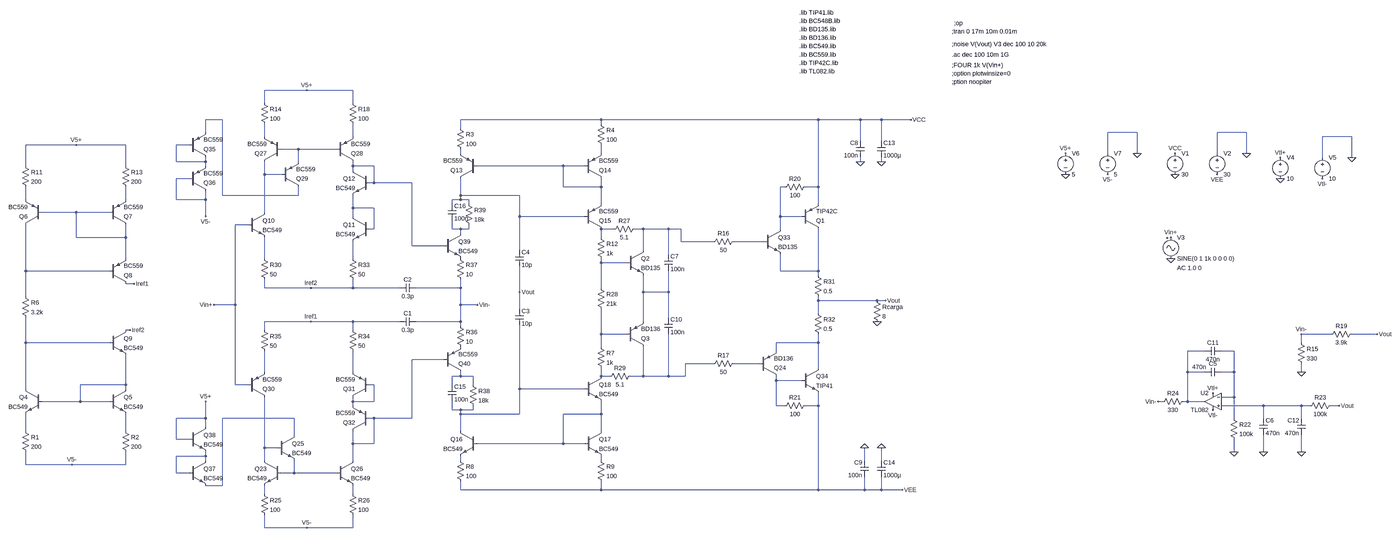
[diagram p0: schematic Current_Feedback_Amplifier.asc, whole sheet]
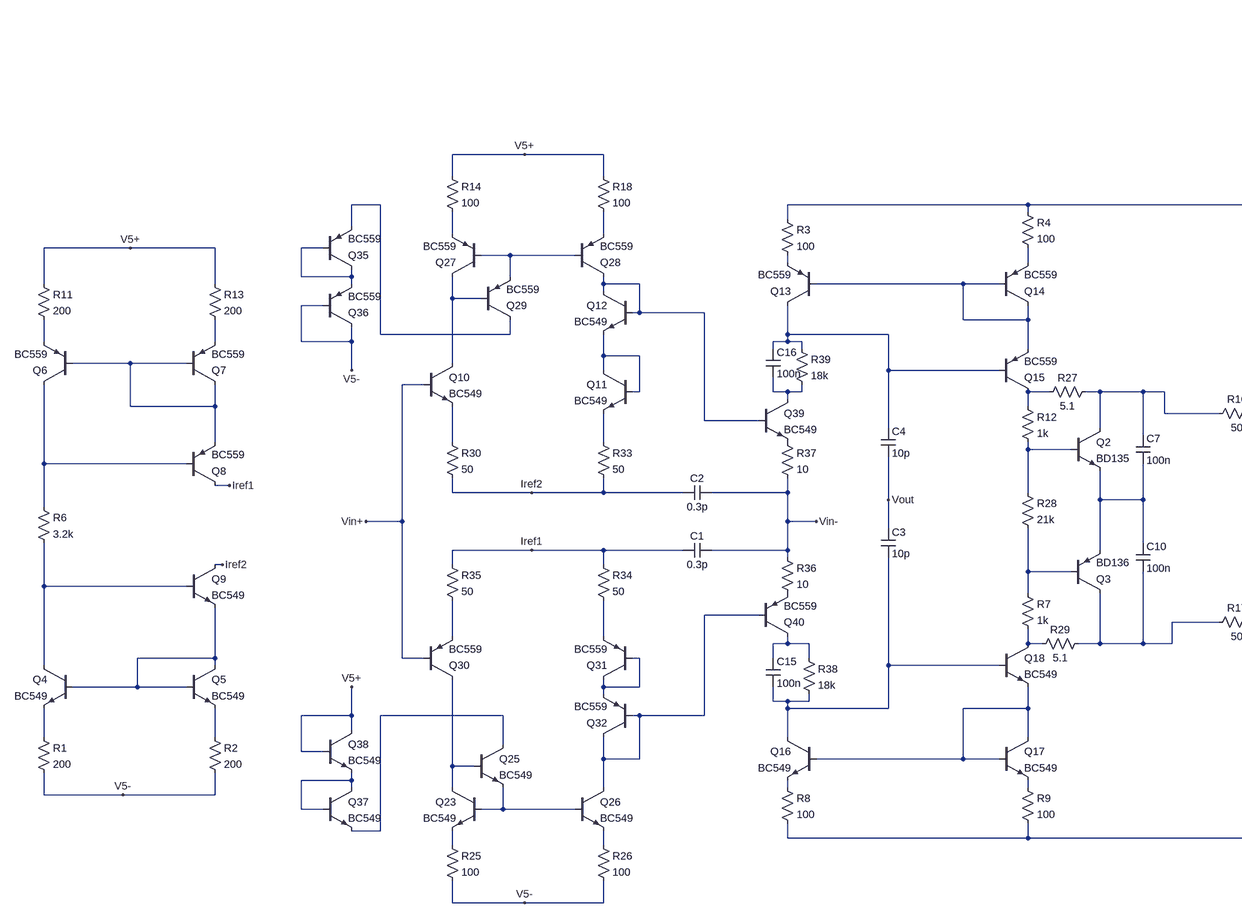
[diagram p1: schematic Current_Feedback_Amplifier.asc, part, row 1 of 1, column 1 of 2]
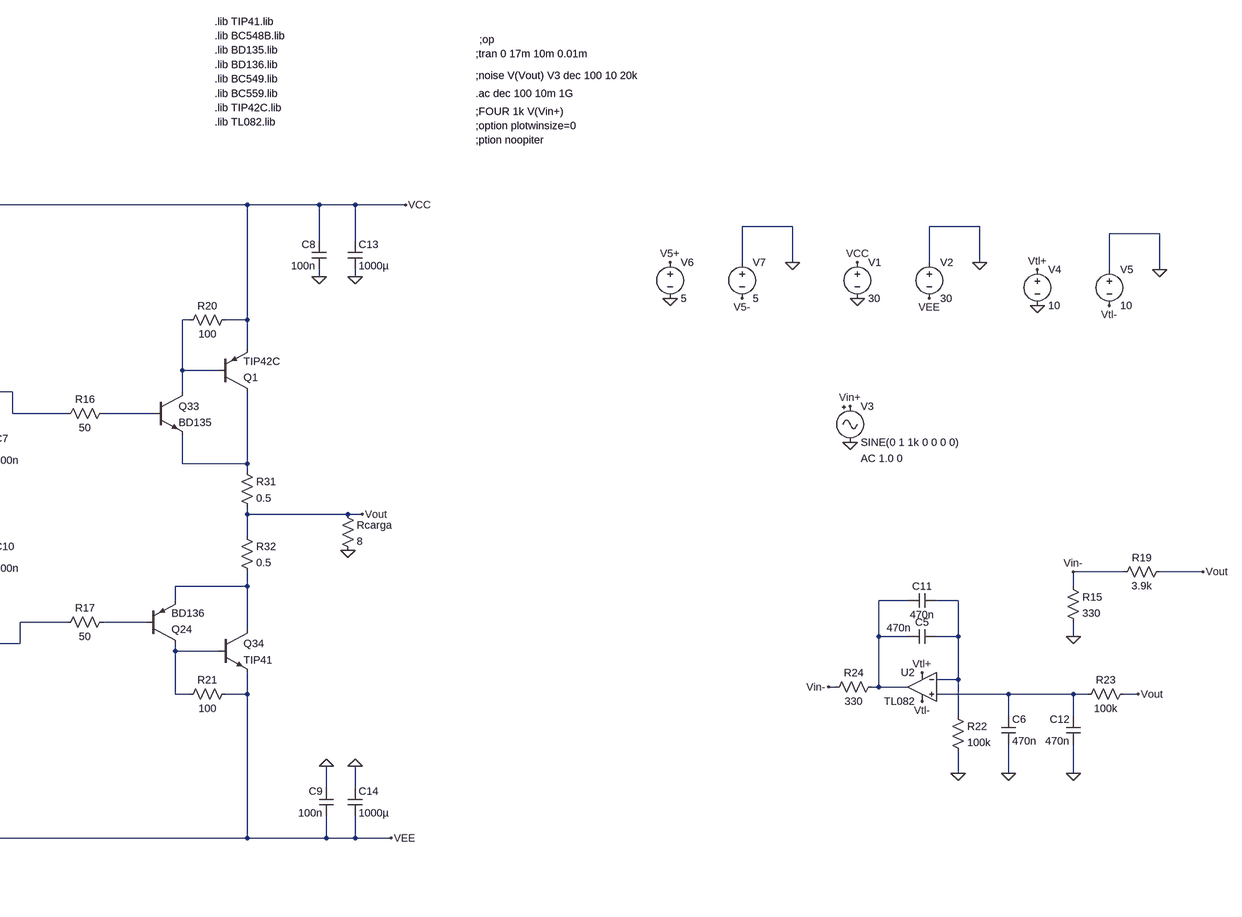
[diagram p2: schematic Current_Feedback_Amplifier.asc, part, row 1 of 1, column 2 of 2]
Current_Feedback_Amplifier.asc, the LTspice schematic file:
Version 4
SHEET 1 5144 1460
WIRE 496 -352 336 -352
WIRE 672 -352 496 -352
WIRE 336 -304 336 -352
WIRE 672 -304 672 -352
WIRE 160 -240 112 -240
WIRE 176 -240 160 -240
WIRE 1648 -240 1104 -240
WIRE 2848 -240 1648 -240
WIRE 3008 -240 2848 -240
WIRE 3088 -240 3008 -240
WIRE 3200 -240 3088 -240
WIRE 1648 -224 1648 -240
WIRE 1104 -208 1104 -240
WIRE 112 -192 112 -240
WIRE 4160 -192 4048 -192
WIRE 4576 -192 4464 -192
WIRE 336 -176 336 -224
WIRE 672 -176 672 -224
WIRE 4976 -176 4864 -176
WIRE 3008 -160 3008 -240
WIRE 3088 -160 3088 -240
WIRE -560 -144 -752 -144
WIRE -368 -144 -560 -144
WIRE 48 -144 0 -144
WIRE 464 -128 400 -128
WIRE 608 -128 464 -128
WIRE 1104 -112 1104 -128
WIRE 1648 -112 1648 -144
WIRE 4048 -112 4048 -192
WIRE 4160 -112 4160 -192
WIRE 4464 -112 4464 -192
WIRE 4576 -112 4576 -192
WIRE 4864 -96 4864 -176
WIRE 4976 -96 4976 -176
WIRE 0 -80 0 -144
WIRE 112 -80 112 -96
WIRE 112 -80 0 -80
WIRE 464 -80 464 -128
WIRE 3008 -80 3008 -96
WIRE 3088 -80 3088 -96
WIRE -752 -64 -752 -144
WIRE -368 -64 -368 -144
WIRE 112 -64 112 -80
WIRE 672 -64 672 -80
WIRE 752 -64 672 -64
WIRE 1504 -64 1168 -64
WIRE 1584 -64 1504 -64
WIRE 672 -48 672 -64
WIRE 336 -32 336 -80
WIRE 400 -32 336 -32
WIRE 48 -16 0 -16
WIRE 752 0 752 -64
WIRE 752 0 736 0
WIRE 896 0 752 0
WIRE 1504 16 1504 -64
WIRE 1648 16 1648 -16
WIRE 1648 16 1504 16
WIRE 2720 16 2704 16
WIRE 2848 16 2848 -240
WIRE 2848 16 2800 16
WIRE 176 48 176 -240
WIRE 464 48 464 16
WIRE 464 48 176 48
WIRE 1104 48 1104 -16
WIRE 1328 48 1104 48
WIRE -752 64 -752 16
WIRE -368 64 -368 16
WIRE 0 64 0 -16
WIRE 112 64 112 32
WIRE 112 64 0 64
WIRE 1104 64 1104 48
WIRE 1104 64 1072 64
WIRE 1136 64 1104 64
WIRE 1072 80 1072 64
WIRE 1136 80 1136 64
WIRE 1648 80 1648 16
WIRE 2848 80 2848 16
WIRE 672 96 672 48
WIRE 752 96 672 96
WIRE -560 112 -688 112
WIRE -432 112 -560 112
WIRE 336 112 336 -32
WIRE 112 128 112 64
WIRE 672 128 672 96
WIRE 1328 128 1328 48
WIRE 1584 128 1328 128
WIRE 2704 128 2704 16
WIRE 2784 128 2704 128
WIRE 272 160 224 160
WIRE 752 176 752 96
WIRE 752 176 736 176
WIRE 1072 176 1072 144
WIRE 1104 176 1072 176
WIRE 1136 176 1136 160
WIRE 1136 176 1104 176
WIRE 1696 176 1648 176
WIRE 1808 176 1776 176
WIRE 1904 176 1808 176
WIRE 1952 176 1904 176
WIRE 2704 176 2704 128
WIRE 1104 192 1104 176
WIRE 1648 192 1648 176
WIRE -560 208 -560 112
WIRE -368 208 -368 160
WIRE -368 208 -560 208
WIRE 1648 208 1648 192
WIRE 1952 224 1952 176
WIRE 2336 224 1952 224
WIRE 2448 224 2336 224
WIRE 2640 224 2528 224
WIRE 896 240 896 0
WIRE 1040 240 896 240
WIRE 1328 256 1328 128
WIRE 1808 256 1808 176
WIRE 1904 272 1904 176
WIRE -368 288 -368 208
WIRE 336 288 336 208
WIRE 672 288 672 224
WIRE 1648 304 1648 288
WIRE 1744 304 1648 304
WIRE -752 336 -752 160
WIRE -432 336 -752 336
WIRE 2704 336 2704 272
WIRE 2848 336 2848 176
WIRE 2848 336 2704 336
WIRE 2848 352 2848 336
WIRE -336 384 -368 384
WIRE 336 400 336 368
WIRE 512 400 336 400
WIRE 672 400 672 368
WIRE 672 400 512 400
WIRE 848 400 672 400
WIRE 1104 400 1104 368
WIRE 1104 400 912 400
WIRE 1648 400 1648 304
WIRE 1328 416 1328 320
WIRE 1808 416 1808 352
WIRE 1904 416 1904 336
WIRE 1904 416 1808 416
WIRE -752 432 -752 336
WIRE 2848 448 2848 432
WIRE 3072 448 2848 448
WIRE 3104 448 3072 448
WIRE 224 464 224 160
WIRE 224 464 144 464
WIRE 1104 464 1104 400
WIRE 1168 464 1104 464
WIRE 1328 480 1328 416
WIRE 2848 496 2848 448
WIRE 1904 512 1904 416
WIRE 512 528 336 528
WIRE 672 528 512 528
WIRE 848 528 672 528
WIRE 1104 528 1104 464
WIRE 1104 528 912 528
WIRE 1808 528 1808 416
WIRE 1104 544 1104 528
WIRE -352 560 -368 560
WIRE 336 560 336 528
WIRE 672 560 672 528
WIRE 1648 576 1648 480
WIRE 1744 576 1648 576
WIRE 4896 576 4784 576
WIRE 5072 576 4976 576
WIRE -752 608 -752 512
WIRE -432 608 -752 608
WIRE 2848 608 2848 576
WIRE 2848 608 2688 608
WIRE 4784 608 4784 576
WIRE 1648 624 1648 576
WIRE 2688 640 2688 608
WIRE 4416 640 4352 640
WIRE 4528 640 4480 640
WIRE 1040 672 896 672
WIRE 2368 688 1968 688
WIRE 2448 688 2368 688
WIRE 2624 688 2528 688
WIRE 2848 704 2848 608
WIRE 336 720 336 640
WIRE 672 720 672 640
WIRE 1648 720 1648 704
WIRE 4352 720 4352 640
WIRE 4416 720 4352 720
WIRE 4528 720 4528 640
WIRE 4528 720 4480 720
WIRE 4784 720 4784 688
WIRE 1104 736 1104 720
WIRE 1104 736 1072 736
WIRE 1152 736 1104 736
WIRE 1648 736 1648 720
WIRE 1680 736 1648 736
WIRE 1808 736 1808 624
WIRE 1808 736 1760 736
WIRE 1904 736 1904 576
WIRE 1904 736 1808 736
WIRE 1968 736 1968 688
WIRE 1968 736 1904 736
WIRE 2688 752 2688 736
WIRE 2784 752 2688 752
WIRE -368 768 -368 656
WIRE -368 768 -544 768
WIRE 224 768 224 464
WIRE 272 768 224 768
WIRE 752 768 736 768
WIRE 1072 768 1072 736
WIRE 1152 768 1152 736
WIRE -752 784 -752 608
WIRE -368 784 -368 768
WIRE 1328 784 1328 544
WIRE 1584 784 1328 784
WIRE 4528 816 4528 720
WIRE 4528 816 4480 816
WIRE -544 832 -544 768
WIRE -544 832 -688 832
WIRE -432 832 -544 832
WIRE 672 832 672 816
WIRE 752 832 752 768
WIRE 752 832 672 832
WIRE 4256 832 4240 832
WIRE 4352 832 4352 720
WIRE 4352 832 4336 832
WIRE 4416 832 4352 832
WIRE 672 848 672 832
WIRE 2688 848 2688 752
WIRE 2720 848 2688 848
WIRE 2848 848 2848 800
WIRE 2848 848 2800 848
WIRE 4640 848 4480 848
WIRE 4784 848 4640 848
WIRE 4816 848 4784 848
WIRE 4928 848 4896 848
WIRE 1072 864 1072 832
WIRE 1104 864 1072 864
WIRE 1152 864 1152 848
WIRE 1152 864 1104 864
WIRE 1104 880 1104 864
WIRE 1328 880 1328 784
WIRE 1328 880 1104 880
WIRE 1648 880 1648 832
WIRE 1648 880 1504 880
WIRE 112 896 112 832
WIRE 112 896 0 896
WIRE 448 896 176 896
WIRE 752 896 736 896
WIRE 896 896 896 672
WIRE 896 896 752 896
WIRE 4528 896 4528 816
WIRE 4640 896 4640 848
WIRE 4784 896 4784 848
WIRE 112 928 112 896
WIRE -752 944 -752 880
WIRE -368 944 -368 880
WIRE 1104 944 1104 880
WIRE 1648 944 1648 880
WIRE 448 960 448 896
WIRE 0 976 0 896
WIRE 48 976 0 976
WIRE 672 992 672 944
WIRE 752 992 752 896
WIRE 752 992 672 992
WIRE 1472 992 1168 992
WIRE 1504 992 1504 880
WIRE 1504 992 1472 992
WIRE 1584 992 1504 992
WIRE 336 1008 336 816
WIRE 384 1008 336 1008
WIRE 4528 1024 4528 976
WIRE 4640 1024 4640 960
WIRE 4784 1024 4784 960
WIRE 112 1040 112 1024
WIRE 112 1040 0 1040
WIRE 112 1056 112 1040
WIRE 336 1056 336 1008
WIRE 672 1056 672 992
WIRE 1104 1056 1104 1040
WIRE 1648 1056 1648 1040
WIRE 3024 1056 3024 1008
WIRE 3088 1056 3088 1008
WIRE -752 1072 -752 1024
WIRE -576 1072 -752 1072
WIRE -368 1072 -368 1024
WIRE -368 1072 -576 1072
WIRE 0 1104 0 1040
WIRE 48 1104 0 1104
WIRE 448 1104 448 1056
WIRE 448 1104 400 1104
WIRE 608 1104 448 1104
WIRE 144 1152 112 1152
WIRE 176 1152 176 896
WIRE 176 1152 144 1152
WIRE 1104 1168 1104 1136
WIRE 1648 1168 1648 1136
WIRE 1648 1168 1104 1168
WIRE 2848 1168 2848 848
WIRE 2848 1168 1648 1168
WIRE 3024 1168 3024 1120
WIRE 3024 1168 2848 1168
WIRE 3088 1168 3088 1120
WIRE 3088 1168 3024 1168
WIRE 3168 1168 3088 1168
WIRE 336 1184 336 1152
WIRE 672 1184 672 1152
WIRE 336 1312 336 1264
WIRE 496 1312 336 1312
WIRE 672 1312 672 1264
WIRE 672 1312 496 1312
FLAG 4304 -112 VCC
FLAG 4304 -32 0
FLAG 4576 -112 0
FLAG 4464 -32 VEE
FLAG 4288 288 0
FLAG 4288 208 Vin+
FLAG 3104 448 Vout
FLAG 4784 720 0
FLAG 4784 576 Vin-
FLAG 5072 576 Vout
FLAG 3072 528 0
FLAG 4528 1024 0
FLAG 4640 1024 0
FLAG 4928 848 Vout
FLAG 4240 832 Vin-
FLAG 4448 864 Vtl-
FLAG 4448 800 Vtl+
FLAG 3168 1168 VEE
FLAG 3024 1008 0
FLAG 3200 -240 VCC
FLAG 3008 -80 0
FLAG 4704 -96 Vtl+
FLAG 4704 -16 0
FLAG 4976 -96 0
FLAG 4864 -16 Vtl-
FLAG 4784 1024 0
FLAG 3088 -80 0
FLAG 3088 1008 0
FLAG 1328 416 Vout
FLAG 3888 -112 V5+
FLAG 3888 -32 0
FLAG 4160 -112 0
FLAG 4048 -32 V5-
FLAG 144 464 Vin+
FLAG 1168 464 Vin-
FLAG 496 -352 V5+
FLAG 496 1312 V5-
FLAG -560 -144 V5+
FLAG -576 1072 V5-
FLAG 112 128 V5-
FLAG 112 832 V5+
FLAG 512 528 Iref1
FLAG -336 384 Iref1
FLAG 512 400 Iref2
FLAG -352 560 Iref2
DATAFLAG 1504 -64 ""
DATAFLAG 160 -240 ""
DATAFLAG 144 1152 ""
DATAFLAG 1104 464 ""
DATAFLAG 224 464 ""
DATAFLAG 1104 48 ""
DATAFLAG 1104 880 ""
DATAFLAG 1472 992 ""
DATAFLAG 1648 192 ""
DATAFLAG 1648 720 ""
DATAFLAG 1648 720 ""
DATAFLAG 2848 448 ""
DATAFLAG 2704 128 ""
DATAFLAG 2688 752 ""
DATAFLAG 2368 688 ""
DATAFLAG 2336 224 ""
SYMBOL voltage 4304 -128 R0
WINDOW 123 0 0 Left 2
WINDOW 39 0 0 Left 2
SYMATTR InstName V1
SYMATTR Value 30
SYMBOL voltage 4464 -128 R0
SYMATTR InstName V2
SYMATTR Value 30
SYMBOL Misc\\signal 4288 192 R0
WINDOW 123 24 132 Left 2
WINDOW 39 0 0 Left 2
SYMATTR Value2 AC 1.0 0
SYMATTR InstName V3
SYMATTR Value SINE(0 1 1k 0 0 0 0)
SYMBOL npn 1168 944 M0
SYMATTR InstName Q16
SYMATTR Value BC549
SYMBOL res 1088 1040 R0
SYMATTR InstName R8
SYMATTR Value 100
SYMBOL npn 1584 944 R0
SYMATTR InstName Q17
SYMATTR Value BC549
SYMBOL res 1632 1040 R0
SYMATTR InstName R9
SYMATTR Value 100
SYMBOL npn 1584 736 R0
SYMATTR InstName Q18
SYMATTR Value BC549
SYMBOL pnp 1584 176 M180
SYMATTR InstName Q15
SYMATTR Value BC559
SYMBOL pnp 1584 -16 M180
SYMATTR InstName Q14
SYMATTR Value BC559
SYMBOL res 1632 -240 R0
SYMATTR InstName R4
SYMATTR Value 100
SYMBOL pnp 1168 -16 R180
SYMATTR InstName Q13
SYMATTR Value BC559
SYMBOL res 1088 -224 R0
SYMATTR InstName R3
SYMATTR Value 100
SYMBOL res 2544 672 R90
WINDOW 0 0 56 VBottom 2
WINDOW 3 32 56 VTop 2
SYMATTR InstName R17
SYMATTR Value 50
SYMBOL res 2544 208 R90
WINDOW 0 0 56 VBottom 2
WINDOW 3 32 56 VTop 2
SYMATTR InstName R16
SYMATTR Value 50
SYMBOL pnp 2624 736 M180
SYMATTR InstName Q24
SYMATTR Value BD136
SYMBOL cap 1312 480 R0
SYMATTR InstName C3
SYMATTR Value 10p
SYMBOL cap 1312 256 R0
SYMATTR InstName C4
SYMATTR Value 10p
SYMBOL res 4768 592 R0
SYMATTR InstName R15
SYMATTR Value 330
SYMBOL res 4992 560 R90
WINDOW 0 0 56 VBottom 2
WINDOW 3 32 56 VTop 2
SYMATTR InstName R19
SYMATTR Value 3.9k
SYMBOL res 3056 432 R0
SYMATTR InstName Rcarga
SYMATTR Value 8
SYMBOL npn 2640 176 R0
SYMATTR InstName Q33
SYMATTR Value BD135
SYMBOL res 2816 0 R90
WINDOW 0 0 56 VBottom 2
WINDOW 3 32 56 VTop 2
SYMATTR InstName R20
SYMATTR Value 100
SYMBOL npn 2784 704 R0
SYMATTR InstName Q34
SYMATTR Value TIP41
SYMBOL res 2816 832 R90
WINDOW 0 0 56 VBottom 2
WINDOW 3 32 56 VTop 2
SYMATTR InstName R21
SYMATTR Value 100
SYMBOL cap 4480 704 R90
WINDOW 0 0 32 VBottom 2
WINDOW 3 -19 84 VTop 2
SYMATTR InstName C5
SYMATTR Value 470n
SYMBOL res 4512 880 R0
SYMATTR InstName R22
SYMATTR Value 100k
SYMBOL res 4912 832 R90
WINDOW 0 0 56 VBottom 2
WINDOW 3 32 56 VTop 2
SYMATTR InstName R23
SYMATTR Value 100k
SYMBOL cap 4624 896 R0
SYMATTR InstName C6
SYMATTR Value 470n
SYMBOL res 4352 816 R90
WINDOW 0 0 56 VBottom 2
WINDOW 3 32 56 VTop 2
SYMATTR InstName R24
SYMATTR Value 330
SYMBOL pnp 2784 176 M180
SYMATTR InstName Q1
SYMATTR Value TIP42C
SYMBOL Opamps\\opamp2 4448 768 M0
SYMATTR InstName U2
SYMATTR Value TL082
SYMBOL cap 3040 1056 M0
SYMATTR InstName C9
SYMATTR Value 100n
SYMBOL cap 3024 -160 M0
SYMATTR InstName C8
SYMATTR Value 100n
SYMBOL res 2832 336 R0
SYMATTR InstName R31
SYMATTR Value 0.5
SYMBOL res 2832 480 R0
SYMATTR InstName R32
SYMATTR Value 0.5
SYMBOL voltage 4704 -112 R0
WINDOW 123 0 0 Left 2
WINDOW 39 0 0 Left 2
SYMATTR InstName V4
SYMATTR Value 10
SYMBOL voltage 4864 -112 R0
SYMATTR InstName V5
SYMATTR Value 10
SYMBOL cap 4480 624 R90
WINDOW 0 0 32 VBottom 2
WINDOW 3 32 32 VTop 2
SYMATTR InstName C11
SYMATTR Value 470n
SYMBOL cap 4800 960 R180
WINDOW 0 24 56 Left 2
WINDOW 3 24 8 Left 2
SYMATTR InstName C12
SYMATTR Value 470n
SYMBOL cap 3072 -160 R0
SYMATTR InstName C13
SYMATTR Value 1000µ
SYMBOL cap 3072 1056 R0
SYMATTR InstName C14
SYMATTR Value 1000µ
SYMBOL npn 1744 256 R0
SYMATTR InstName Q2
SYMATTR Value BD135
SYMBOL pnp 1744 624 M180
SYMATTR InstName Q3
SYMATTR Value BD136
SYMBOL res 1632 608 R0
SYMATTR InstName R7
SYMATTR Value 1k
SYMBOL res 1632 192 R0
SYMATTR InstName R12
SYMATTR Value 1k
SYMBOL res 1632 384 R0
SYMATTR InstName R28
SYMATTR Value 21k
SYMBOL voltage 3888 -128 R0
WINDOW 123 0 0 Left 2
WINDOW 39 0 0 Left 2
SYMATTR InstName V6
SYMATTR Value 5
SYMBOL voltage 4048 -128 R0
SYMATTR InstName V7
SYMATTR Value 5
SYMBOL npn -688 784 M0
SYMATTR InstName Q4
SYMATTR Value BC549
SYMBOL npn -432 784 R0
SYMATTR InstName Q5
SYMATTR Value BC549
SYMBOL res -768 928 R0
SYMATTR InstName R1
SYMATTR Value 200
SYMBOL res -384 928 R0
SYMATTR InstName R2
SYMATTR Value 200
SYMBOL res -768 416 R0
SYMATTR InstName R6
SYMATTR Value 3.2k
SYMBOL res -768 -80 R0
SYMATTR InstName R11
SYMATTR Value 200
SYMBOL res -384 -80 R0
SYMATTR InstName R13
SYMATTR Value 200
SYMBOL pnp -688 160 R180
SYMATTR InstName Q6
SYMATTR Value BC559
SYMBOL pnp -432 160 M180
SYMATTR InstName Q7
SYMATTR Value BC559
SYMBOL pnp -432 384 M180
SYMATTR InstName Q8
SYMATTR Value BC559
SYMBOL npn -432 560 R0
SYMATTR InstName Q9
SYMATTR Value BC549
SYMBOL npn 272 112 R0
SYMATTR InstName Q10
SYMATTR Value BC549
SYMBOL npn 736 128 M0
SYMATTR InstName Q11
SYMATTR Value BC549
SYMBOL npn 736 -48 M0
SYMATTR InstName Q12
SYMATTR Value BC549
SYMBOL npn 400 1056 M0
SYMATTR InstName Q23
SYMATTR Value BC549
SYMBOL npn 384 960 R0
SYMATTR InstName Q25
SYMATTR Value BC549
SYMBOL npn 608 1056 R0
SYMATTR InstName Q26
SYMATTR Value BC549
SYMBOL pnp 400 -80 R180
SYMATTR InstName Q27
SYMATTR Value BC559
SYMBOL pnp 608 -80 M180
SYMATTR InstName Q28
SYMATTR Value BC559
SYMBOL pnp 400 16 M180
SYMATTR InstName Q29
SYMATTR Value BC559
SYMBOL pnp 272 816 M180
SYMATTR InstName Q30
SYMATTR Value BC559
SYMBOL pnp 736 816 R180
SYMATTR InstName Q31
SYMATTR Value BC559
SYMBOL pnp 736 944 R180
SYMATTR InstName Q32
SYMATTR Value BC559
SYMBOL res 320 -320 R0
SYMATTR InstName R14
SYMATTR Value 100
SYMBOL res 656 -320 R0
SYMATTR InstName R18
SYMATTR Value 100
SYMBOL res 320 1168 R0
SYMATTR InstName R25
SYMATTR Value 100
SYMBOL res 656 1168 R0
SYMATTR InstName R26
SYMATTR Value 100
SYMBOL pnp 48 -96 M180
SYMATTR InstName Q35
SYMATTR Value BC559
SYMBOL pnp 48 32 M180
SYMATTR InstName Q36
SYMATTR Value BC559
SYMBOL npn 48 1056 R0
SYMATTR InstName Q37
SYMATTR Value BC549
SYMBOL npn 48 928 R0
SYMATTR InstName Q38
SYMATTR Value BC549
SYMBOL cap 912 512 R90
WINDOW 0 0 32 VBottom 2
WINDOW 3 32 32 VTop 2
SYMATTR InstName C1
SYMATTR Value 0.3p
SYMBOL cap 912 384 R90
WINDOW 0 0 32 VBottom 2
WINDOW 3 32 32 VTop 2
SYMATTR InstName C2
SYMATTR Value 0.3p
SYMBOL npn 1040 192 R0
SYMATTR InstName Q39
SYMATTR Value BC549
SYMBOL pnp 1040 720 M180
SYMATTR InstName Q40
SYMATTR Value BC559
SYMBOL res 1792 160 R90
WINDOW 0 0 56 VBottom 2
WINDOW 3 32 56 VTop 2
SYMATTR InstName R27
SYMATTR Value 5.1
SYMBOL res 1776 720 R90
WINDOW 0 0 56 VBottom 2
WINDOW 3 32 56 VTop 2
SYMATTR InstName R29
SYMATTR Value 5.1
SYMBOL cap 1888 272 R0
SYMATTR InstName C7
SYMATTR Value 100n
SYMBOL cap 1888 512 R0
SYMATTR InstName C10
SYMATTR Value 100n
SYMBOL res 320 272 R0
SYMATTR InstName R30
SYMATTR Value 50
SYMBOL res 656 272 R0
SYMATTR InstName R33
SYMATTR Value 50
SYMBOL res 656 544 R0
SYMATTR InstName R34
SYMATTR Value 50
SYMBOL res 320 544 R0
SYMATTR InstName R35
SYMATTR Value 50
SYMBOL res 1088 528 R0
SYMATTR InstName R36
SYMATTR Value 10
SYMBOL res 1088 272 R0
SYMATTR InstName R37
SYMATTR Value 10
SYMBOL cap 1056 768 R0
SYMATTR InstName C15
SYMATTR Value 100n
SYMBOL res 1136 752 R0
SYMATTR InstName R38
SYMATTR Value 18k
SYMBOL res 1120 64 R0
SYMATTR InstName R39
SYMATTR Value 18k
SYMBOL cap 1056 80 R0
SYMATTR InstName C16
SYMATTR Value 100n
TEXT 3456 -576 Left 2 !;tran 0 17m 10m 0.01m
TEXT 3456 -488 Left 2 !.ac dec 100 10m 1G
TEXT 2776 -648 Left 2 !.lib TIP41.lib
TEXT 2776 -584 Left 2 !.lib BD135.lib
TEXT 2776 -552 Left 2 !.lib BD136.lib
TEXT 2776 -616 Left 2 !.lib BC548B.lib
TEXT 3456 -528 Left 2 !;noise V(Vout) V3 dec 100 10 20k
TEXT 2776 -520 Left 2 !.lib BC549.lib
TEXT 2776 -488 Left 2 !.lib BC559.lib
TEXT 3464 -608 Left 2 !;op
TEXT 2776 -456 Left 2 !.lib TIP42C.lib
TEXT 3456 -448 Left 2 !;FOUR 1k V(Vin+)
TEXT 3456 -416 Left 2 !;option plotwinsize=0
TEXT 3456 -384 Left 2 !;ption noopiter
TEXT 2776 -424 Left 2 !.lib TL082.lib

The netlist it stands for:
* Current_Feedback_Amplifier.asc
V1 VCC 0 30
V2 0 VEE 30
V3 Vin+ 0 SINE(0 1 1k 0 0 0 0) AC 1.0 0
Q16 N042 N044 N050 0 BC549
R8 N050 VEE 100
Q17 N044 N044 N051 0 BC549
R9 N051 VEE 100
Q18 N037 N042 N044 0 BC549
Q15 N018 N012 N009 0 BC559
Q14 N009 N009 N007 0 BC559
R4 VCC N007 100
Q13 N012 N009 N006 0 BC559
R3 VCC N006 100
R17 N034 N033 50
R16 N020 N019 50
Q24 N039 N034 N029 0 BD136
C3 Vout N042 10p
C4 N012 Vout 10p
R15 Vin- 0 330
R19 Vout Vin- 3.9k
Rcarga Vout 0 8
Q33 N011 N020 N025 0 BD135
R20 VCC N011 100
Q34 N029 N039 VEE 0 TIP41
R21 VEE N039 100
C5 N031 N030 470n
R22 N031 0 100k
R23 Vout N043 100k
C6 N043 0 470n
R24 N030 Vin- 330
Q1 N025 N011 VCC 0 TIP42C
XU2 N043 N031 Vtl+ Vtl- N030 TL082  ; pins In+ In- V+ V- OUT
C9 0 VEE 100n
C8 VCC 0 100n
R31 N025 Vout 0.5
R32 Vout N029 0.5
V4 Vtl+ 0 10
V5 0 Vtl- 10
C11 N031 N030 470n
C12 0 N043 470n
C13 VCC 0 1000µ
C14 0 VEE 1000µ
Q2 N019 N023 N026 0 BD135
Q3 N033 N027 N026 0 BD136
R7 N027 N037 1k
R12 N018 N023 1k
R28 N023 N027 21k
V6 V5+ 0 5
V7 0 V5- 5
Q4 N028 N040 N046 0 BC549
Q5 N040 N040 N047 0 BC549
R1 N046 V5- 200
R2 N047 V5- 200
R6 N024 N028 3.2k
R11 V5+ N013 200
R13 V5+ N014 200
Q6 N024 N016 N013 0 BC559
Q7 N016 N016 N014 0 BC559
Q8 Iref1 N024 N016 0 BC559
Q9 Iref2 N028 N040 0 BC549
Q10 N010 Vin+ N021 0 BC549
Q11 N015 N015 N022 0 BC549
Q12 N008 N008 N015 0 BC549
Q23 N048 N052 N053 0 BC549
Q25 N045 N048 N052 0 BC549
Q26 N032 N052 N054 0 BC549
Q27 N010 N005 N002 0 BC559
Q28 N008 N005 N003 0 BC559
Q29 N001 N010 N005 0 BC559
Q30 N048 Vin+ N035 0 BC559
Q31 N041 N041 N036 0 BC559
Q32 N032 N032 N041 0 BC559
R14 V5+ N002 100
R18 V5+ N003 100
R25 N053 V5- 100
R26 N054 V5- 100
Q35 N004 N004 N001 0 BC559
Q36 V5- V5- N004 0 BC559
Q37 N049 N049 N045 0 BC549
Q38 V5+ V5+ N049 0 BC549
C1 Vin- Iref1 0.3p
C2 Vin- Iref2 0.3p
Q39 N017 N008 P001 0 BC549
Q40 N038 N032 P002 0 BC559
R27 N019 N018 5.1
R29 N033 N037 5.1
C7 N019 N026 100n
C10 N026 N033 100n
R30 N021 Iref2 50
R33 N022 Iref2 50
R34 Iref1 N036 50
R35 Iref1 N035 50
R36 Vin- P002 10
R37 P001 Vin- 10
C15 N038 N042 100n
R38 N038 N042 18k
R39 N012 N017 18k
C16 N012 N017 100n
.model NPN NPN
.model PNP PNP
.lib standard.bjt
;tran 0 17m 10m 0.01m
.ac dec 100 10m 1G
.lib TIP41.lib
.lib BD135.lib
.lib BD136.lib
.lib BC548B.lib
;noise V(Vout) V3 dec 100 10 20k
.lib BC549.lib
.lib BC559.lib
;op
.lib TIP42C.lib
;FOUR 1k V(Vin+)
;option plotwinsize=0
;ption noopiter
.lib TL082.lib
.backanno
.end